# EAGLE design JST2 switch (EAGLE 6.4)
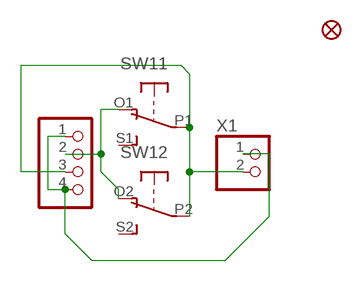
[diagram p0: schematic, sheet 1]

## Parts
FID1  FIDUCIAL""  [FIDUCIAL_1MM]
JP1  PADS-4  [PADS-4]
SW1  DPDT-EG1390  [EG1390]
X1  CON_JST_PH_2PIN  [JSTPH2]

## Nets
GND: JP1.1 JP1.4 X1.1
N$1: JP1.3 SW1.P1(1:P) SW1.P2(2:P) X1.2
N$2: JP1.2 SW1.O1(1:O) SW1.O2(2:O)
Unconnected: SW1.S1(1:S) SW1.S2(2:S)

## Library data of the parts
FID1 = microbuilder:FIDUCIAL: Fiducial Alignment Points Various fiducial points for machine vision alignment.; BOM: EXCLUDE
JP1 = breakouts:PADS-4: PIN HEADER
SW1 = adafruit2:DPDT
X1 = microbuilder:CON_JST_PH_2PIN: JST 2-Pin Right-Angle Connector PH-Series - 4UConnector: 17311 SH-Series - 4UConnector: 07278

## Board
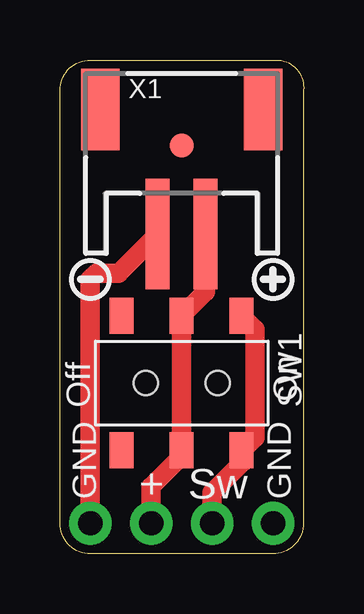
[diagram p1: board, top side]
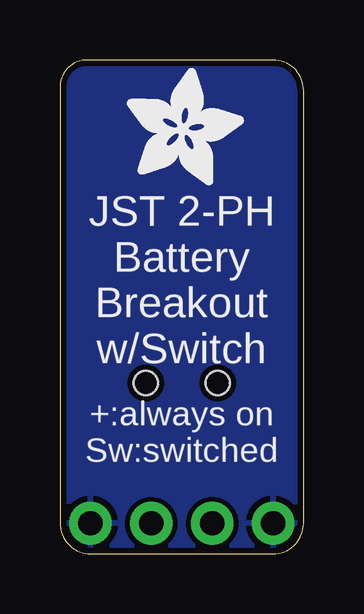
[diagram p2: board, bottom side, seen from below]

Size 10.17 x 20.57 mm. Coordinates in mm from the lower left corner, seen from the top.
Outline: 0,1.27 0,19.3 arc-90 1.27,20.57 9.14,20.57 arc-90 10.16,19.3 10.16,1.27 arc-90 8.89,0 1.27,0 arc-90 0,1.27
Copper layers (1*16): Top 0.035mm / dielectric 1.5mm / Bottom 0.035mm
Design rules "default": minimum track width 10mil, minimum drill 16mil, track to track 8mil, track to pad 8mil, pad to pad 8mil, via to via 8mil, smd to smd 8mil, copper to edge 10mil, drill to drill 8mil, minimum pad ring 10mil, minimum via ring 8mil, stop-mask expansion 4mil, vias tented up to drill 20mil, thermal gap 10mil

### Footprints (pad centres in the part's own frame; a part is rotated, then mirrored left to right if it is on the bottom)
FIDUCIAL_1MM = smd 1 x 1: 1 0,0
PADS-4 = drill 1.016 pad 1.778: 1 -3.81,0; 2 -1.27,0; 3 1.27,0; 4 3.81,0
EG1390 = smd 1 x 1.5: O1 -2.5,2.8; O2 -2.5,-2.8; P1 0,2.8; P2 0,-2.8; S1 2.5,2.8; S2 2.5,-2.8 | hole 1: 1.5,0; -1.5,0
JSTPH2 = smd 1 x 4.6: 1 -1,-3.7; 2 1,-3.7 | smd 1.6 x 3.4: NC1 -3.4,1.5; NC2 3.4,1.5

### Placement (x,y rotation side)
FID1  5.08,17.02 0 top
JP1  5.08,1.27 180 top
SW1  5.08,7.11 180 top
U$1  [SYMBOL_PLUS]  8.89,11.43 0 top
U$2  [SYMBOL_MINUS]  1.27,11.43 0 top
U$3  [ADAFRUIT_5MM]  7.37,15.37 0 bottom
X1  5.08,17.02 0 top

### Tracks (layer width: path | path; a pad name or v marks a point on that pad's centre or on a via)
GND
  Top 0.813: X1.1 2.45,11.68 1.52,11.68 1.27,11.43 JP1.4
  pour Bottom: 0,20.57 0,0 10.16,0 10.16,20.57
N$1
  Top 0.813: X1.2 6.08,10.91 SW1.P2 SW1.P1 5.08,4.06 3.81,2.79 JP1.3
N$2
  Top 0.813: SW1.O2 8.13,9.36 8.13,4.83 7.61,4.31 | 7.61,4.31 SW1.O1 | 7.61,4.31 7.61,3.8 6.35,2.54 JP1.2

### Text on the board
tPlace: Off | On | GND | + | Sw | GND
bPlace: JST 2-PH / Battery / Breakout / w/Switch | +:always on / Sw:switched